# EAGLE schematic pyro_driver (EAGLE 9.6.2)
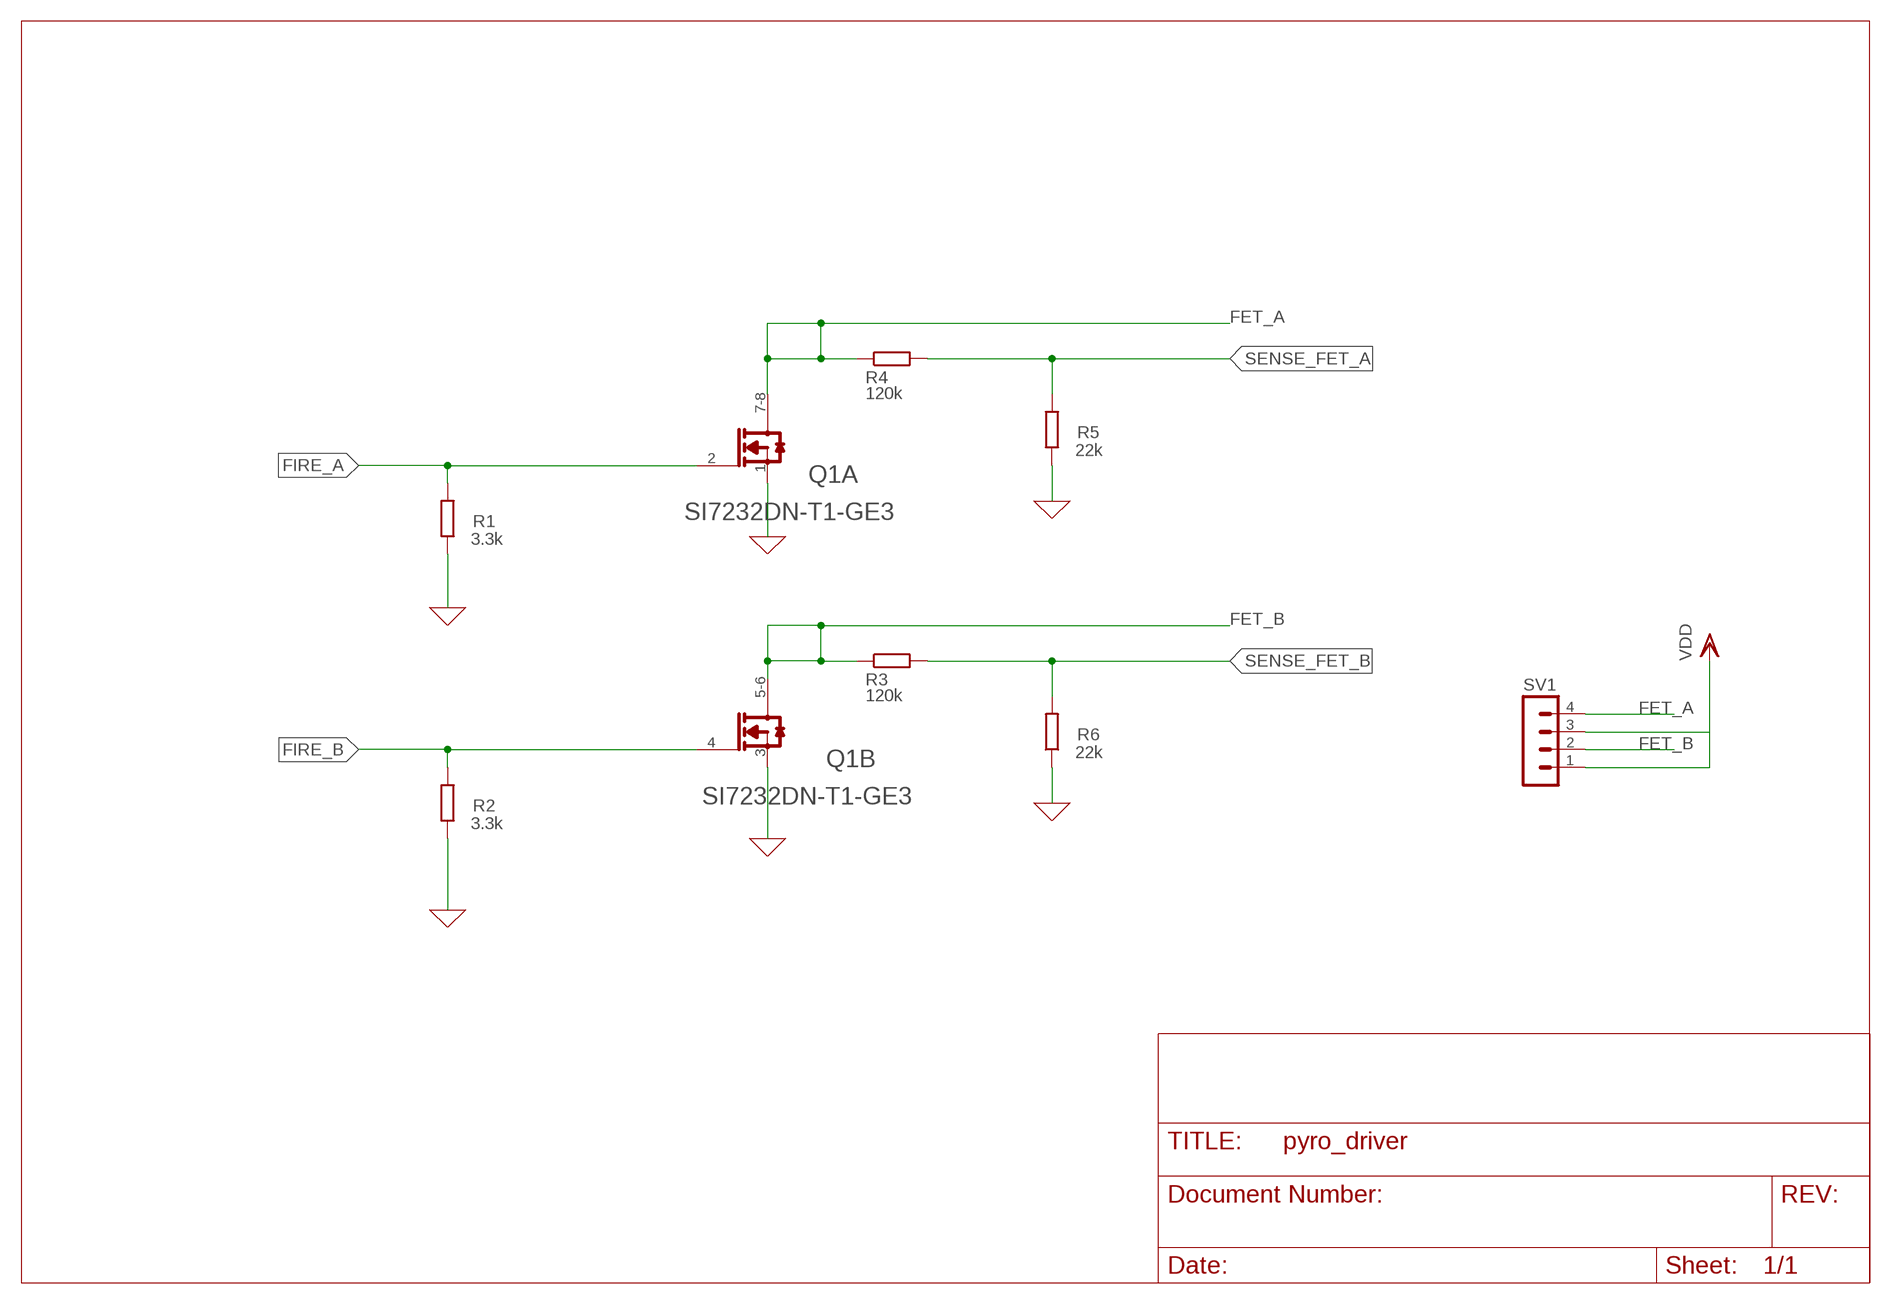
[diagram p0: schematic, sheet 1]

## Parts
Q1  VISHAY_SI7232DN-T1-GE3VISHAY_SI7232DN-T1-GE3_0_0  [VISHAY_SI7232DN-T1-GE3_0]
R1  3.3k  R-EU_R0603  [R0603]
R2  3.3k  R-EU_R0603  [R0603]
R3  120k  R-EU_R0603  [R0603]
R4  120k  R-EU_R0603  [R0603]
R5  22k  R-EU_R0603  [R0603]
R6  22k  R-EU_R0603  [R0603]
SV1  MA04-1  [MA04-1]

## Nets
0: Q1.1(A:S1) Q1.3(B:S2) R1.1 R2.1 R5.1 R6.1 ; supply symbol labelled GND
FET_A: Q1.7-8(A:D1) R4.1 SV1.4
FET_B: Q1.5-6(B:D2) R3.1 SV1.2
FIRE_A: Q1.2(A:G1) R1.2
FIRE_B: Q1.4(B:G2) R2.2
SENSE_FET_A: R4.2 R5.2
SENSE_FET_B: R3.2 R6.2
VDD: SV1.1 SV1.3

## Library data of the parts
Q1 = Vishay - SI7232DN-T1-GE3:VISHAY_SI7232DN-T1-GE3: Mosfet Array 2 N-Channel (Dual) 20V 25A 23W Surface Mount PowerPAK® 1212-8 Dual; AUTOMOTIVE: No; CENTROID_NOT_SPECIFIED: No; CONTINUOUS_DRAIN_CURRENT: 10A; DATASHEET: http://www.vishay.com/docs/68986/si7232dn.pdf; DEPLETION_MODE: False; DEVICE_CLASS_L1: Discrete Semiconductors; DEVICE_CLASS_L2: Transistors; DEVICE_CLASS_L3: MOSFETs; DIGIKEY_DESCRIPTION: MOSFET 2N-CH 20V 25A PPAK 1212-8; DIGIKEY_PART_NUMBER: SI7232DN-T1-GE3CT-ND; DRAIN_TO_SOURCE_BREAKDOWN_VOLTAGE: 20V; DRAIN_TO_SOURCE_RESISTANCE: 0.0135Ω; DRAIN_TO_SOURCE_VOLTAGE: 20V; FOOTPRINT_VARIANT_NAME_0: Recommended_Land_Pattern; GATE_CHARGE_AT_VGS: 21nC @ 8V; GATE_TO_SOURCE_VOLTAGE: 8V; HEIGHT: 1.17mm; INPUT_CAPACITACE_AT_VDS: 1220pF @ 10V; LEAD_FREE: Yes; MAX_FORWARD_DIODE_VOLTAGE: 1.2V; MAX_JUNCTION_TEMP: +150°C; MF: Vishay; MFG_PACKAGE_IDENT: S16-2667-DUAL; MFG_PACKAGE_IDENT_DATE: 01/2017; MFG_PACKAGE_IDENT_REV: M; MOUSER_DESCRIPTION: MOSFET 20V 25A 23W 16.4mohm @ 4.5V; MOUSER_PART_NUMBER: 781-SI7232DN-GE3; MPN: SI7232DN-T1-GE3; NUMBER_OF_CHANNELS: 2; NUMBER_OF_N_CHANNELS: 2; PACKAGE: PowerPAK® 1212-8 Dual; POWER_DISSIPATION: 2.6W; PREFIX: Q; PULSE_DRAIN_CURRENT: 40A; REVERSE_RECOVERY_CHARGE: 15nC; REVERSE_RECOVERY_TIME: 20ns; ROHS: Yes; RTHJA_MAX: 38°C/W; STANDOFF_HEIGHT: 0mm; TEMPERATURE_RANGE_HIGH: +150°C; TEMPERATURE_RANGE_LOW: -55°C; THRESHOLD_VGS_MAX: 1V; THRESHOLD_VGS_MIN: 0.4V; TRANSCONDUCTANCE: 47S; TURN_OFF_DELAY_TIME: 35ns; TURN_ON_DELAY_TIME: 10ns; TYP_FORWARD_DIODE_VOLTAGE: 0.81V; VERIFICATION_VERSION: 0.0.0.3
R1-R6 = rcl:R-EU_: RESISTOR, European symbol; SPICEPREFIX: R
SV1 = con-lstb:MA04-1: PIN HEADER; OC_FARNELL: unknown; OC_NEWARK: unknown